# EAGLE schematic mainboard.pa2 (EAGLE 4.11)
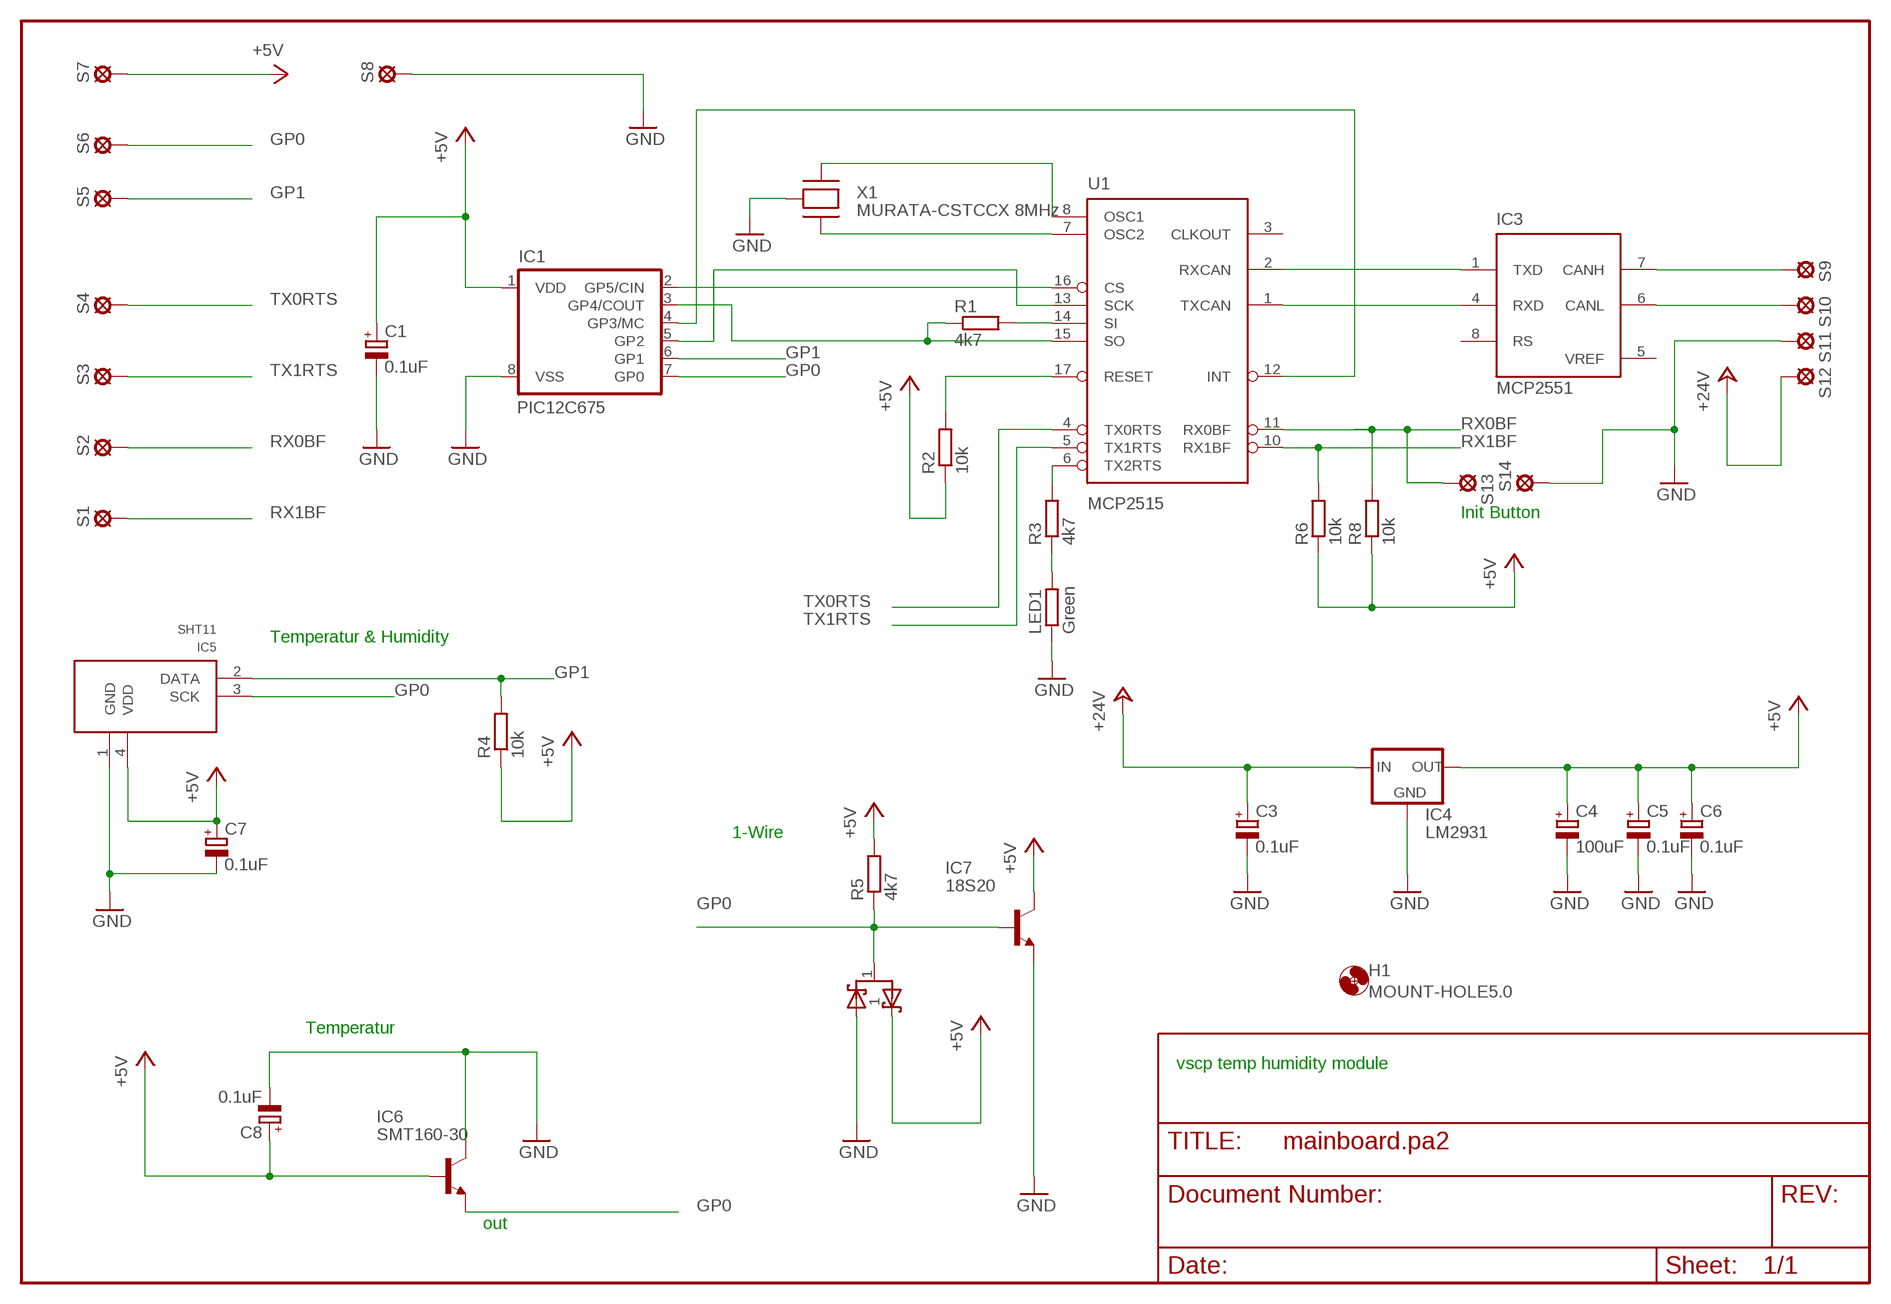
[diagram p0: schematic, sheet 1]

## Parts
C1  0.1uF  CPOL-EUCT3216  [CT3216]
C3  0.1uF  CPOL-EUCT3216  [CT3216]
C4  100uF  CPOL-EUCT7343  [CT7343]
C5  0.1uF  CPOL-EUCT3216  [CT3216]
C6  0.1uF  CPOL-EUCT3216  [CT3216]
C7  0.1uF  CPOL-EUCT3216  [CT3216]
C8  0.1uF  CPOL-EUCT3216  [CT3216]
H1  MOUNT-HOLE5.0  [5,0]
IC1  PIC12C675  PIC12C672SM  [SO-08M]
IC3  MCP2551  MCP2551SN  [SO-08]
IC4  LM2931  78LXX  [78LXX]
IC5  SHT11  SHT1X  [SHT1X]
IC6  SMT160-30  BC547  [TO92]
IC7  18S20  BC547  [TO92]
LED1  Green  R-EU_R1206  [R1206]
R1  4k7  R-EU_R0805  [R0805]
R2  10k  R-EU_R0805  [R0805]
R3  4k7  R-EU_R0805  [R0805]
R4  10k  R-EU_R0805  [R0805]
R5  4k7  R-EU_R0805  [R0805]
R6  10k  R-EU_R0805  [R0805]
R8  10k  R-EU_R0805  [R0805]
S1  SE11  [SE11]
S2  SE11  [SE11]
S3  SE11  [SE11]
S4  SE11  [SE11]
S5  SE11  [SE11]
S6  SE11  [SE11]
S7  SE11  [SE11]
S8  SE11  [SE11]
S9  SE11  [SE11]
S10  SE11  [SE11]
S11  SE11  [SE11]
S12  SE11  [SE11]
S13  SE11  [SE11]
S14  SE11  [SE11]
U1  MCP2515  MCP2510SO  [SO-18W]
U$1  BAT54SCT  [SOT23]
X1  MURATA-CSTCCX 8MHz  MURATA-CSTCCX  [RESONATOR-MURATA-CSTCCX]

## Nets
+5V: C1.+ C4.+ C5.+ C6.+ C7.+ C8.+ IC1.1(VDD) IC4.OUT IC5.4(VDD) IC6.2(B) IC7.3(C) R2.1 R4.1 R5.2 R6.1 R8.1 S7.MP U$1.2
+24V: C3.+ IC4.IN S12.MP
GND: C1.- C3.- C4.- C5.- C6.- C7.- C8.- IC1.8(VSS) IC4.GND IC5.1(GND) IC6.3(C) IC7.1(E) LED1.1 S8.MP S11.MP S14.MP U$1.3 X1.3(GND)
GP0: IC1.7(GP0) IC5.3(SCK) IC6.1(E) IC7.2(B) R5.1 S6.MP U$1.1
GP1: IC1.6(GP1) IC5.2(DATA) R4.2 S5.MP
GP2: IC1.5(GP2) U1.13(SCK)
GP3: IC1.4(GP3/MC) U1.12(INT)
GP4: IC1.3(GP4/COUT) R1.1 U1.15(SO)
GP5: IC1.2(GP5/CIN) U1.16(CS)
N$1: IC3.1(TXD) U1.2(RXCAN)
N$2: IC3.4(RXD) U1.1(TXCAN)
N$3: R2.2 U1.17(RESET)
N$4: IC3.7(CANH) S9.MP
N$5: IC3.6(CANL) S10.MP
N$7: R1.2 U1.14(SI)
N$10: LED1.2 R3.1
OSC1: U1.8(OSC1) X1.2(XTIN)
OSC2: U1.7(OSC2) X1.1(XTOUT)
RX0BF: R8.2 S2.MP S13.MP U1.11(RX0BF)
RX1BF: R6.2 S1.MP U1.10(RX1BF)
TX0RTS: S4.MP U1.4(TX0RTS)
TX1RTS: S3.MP U1.5(TX1RTS)
TX2RTS: R3.2 U1.6(TX2RTS)
Unconnected: IC3.8(RS) U1.3(CLKOUT)

## Notes on the sheet
- Init Button
- Temperatur & Humidity
- 1-Wire
- Temperatur
- vscp temp humidity module
- out

## Power pins joined to a net without a drawn wire
VDD: IC3.3(VDD) U1.18(VDD)
VREF: IC3.5(VREF)
VSS: IC3.2(VSS) U1.9(VSS)

## Library data of the parts
C1 C3-C8 = rcl:CPOL-EU: POLARIZED CAPACITOR, European symbol
H1 = holes:MOUNT-HOLE: MOUNTING HOLE with drill center marker
IC1 = microchip:PIC12C*?: MICROCONTROLLER
IC3 = microchip_can:MCP2551: High Speed CAN tranceiver
IC4 = v-reg:78LXX: VOLTAGE REGULATOR
IC5 = eurosource_ftdi:SHT1X
IC6 IC7 = transistor-npn:BC547*: NPN Transistor
LED1 R1-R6 R8 = rcl:R-EU_: RESISTOR, European symbol
S1-S14 = solpad:SE11: SOLDER PAD RTM, drill 1,1mm, distributor Buerklin, 07F810
U1 = microchip_can:MCP2510
U$1 = dallas:BAT54S
X1 = eurosource_ftdi:MURATA-CSTCCX